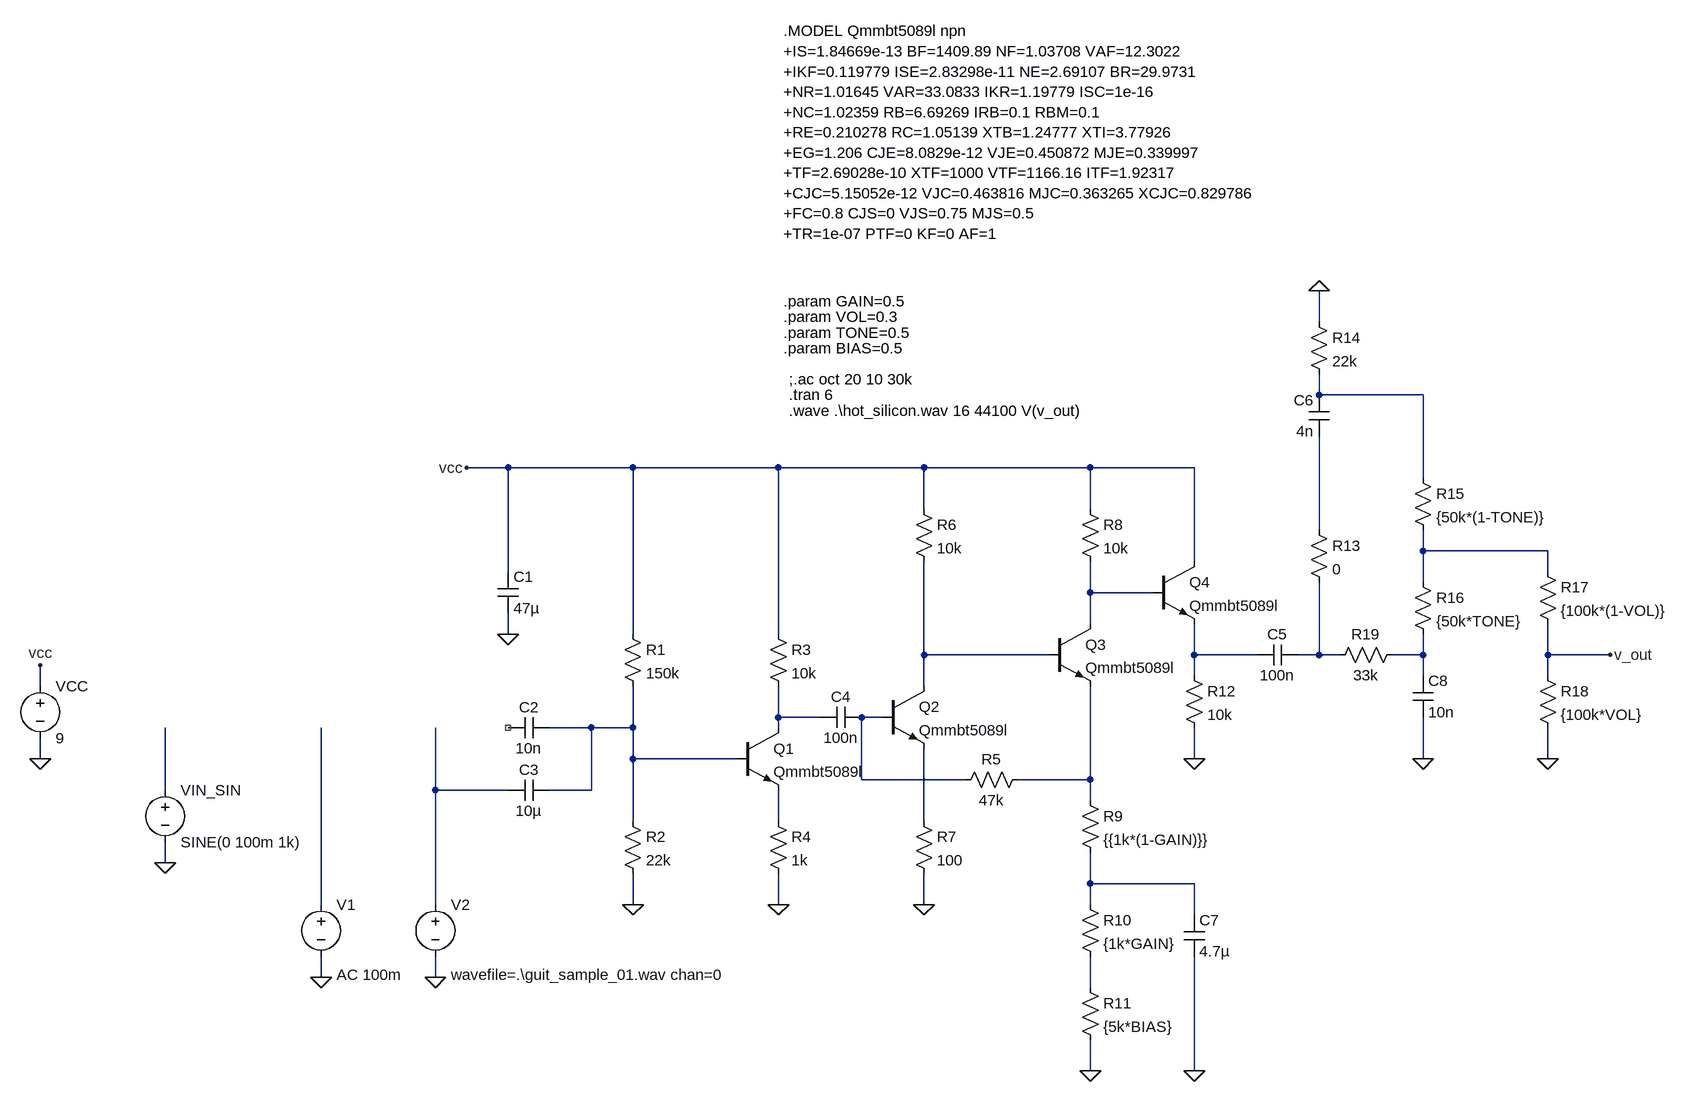
[diagram p0: schematic hot_silicon_02.asc]
hot_silicon_02.asc, the LTspice schematic file:
Version 4
SHEET 1 2596 884
WIRE 1568 -480 1568 -528
WIRE 1568 -368 1568 -400
WIRE 1728 -368 1568 -368
WIRE 320 -256 256 -256
WIRE 512 -256 320 -256
WIRE 736 -256 512 -256
WIRE 960 -256 736 -256
WIRE 1216 -256 960 -256
WIRE 1376 -256 1216 -256
WIRE 1728 -240 1728 -368
WIRE 960 -192 960 -256
WIRE 1216 -192 1216 -256
WIRE 1568 -160 1568 -304
WIRE 1728 -128 1728 -160
WIRE 1920 -128 1728 -128
WIRE 1376 -112 1376 -256
WIRE 320 -96 320 -256
WIRE 1920 -96 1920 -128
WIRE 1728 -80 1728 -128
WIRE 1216 -64 1216 -112
WIRE 1312 -64 1216 -64
WIRE 1216 -16 1216 -64
WIRE 320 0 320 -32
WIRE 512 0 512 -256
WIRE 736 0 736 -256
WIRE 960 32 960 -112
WIRE 1152 32 960 32
WIRE 1376 32 1376 -16
WIRE 1472 32 1376 32
WIRE 1568 32 1568 -80
WIRE 1568 32 1536 32
WIRE 1600 32 1568 32
WIRE 1728 32 1728 0
WIRE 1728 32 1680 32
WIRE 1920 32 1920 -16
WIRE 2016 32 1920 32
WIRE 1376 64 1376 32
WIRE 1728 64 1728 32
WIRE 1920 64 1920 32
WIRE -400 80 -400 48
WIRE 960 80 960 32
WIRE 736 128 736 80
WIRE 800 128 736 128
WIRE 896 128 864 128
WIRE 448 144 384 144
WIRE 512 144 512 80
WIRE 512 144 448 144
WIRE 736 144 736 128
WIRE -400 192 -400 160
WIRE 512 192 512 144
WIRE 672 192 512 192
WIRE 1376 192 1376 144
WIRE 1728 192 1728 128
WIRE 1920 192 1920 144
WIRE 864 224 864 128
WIRE 1024 224 864 224
WIRE 1216 224 1216 80
WIRE 1216 224 1104 224
WIRE -208 240 -208 144
WIRE 208 240 208 144
WIRE 320 240 208 240
WIRE 448 240 448 144
WIRE 448 240 384 240
WIRE 1216 256 1216 224
WIRE 512 288 512 192
WIRE 736 288 736 240
WIRE 960 288 960 176
WIRE -208 352 -208 320
WIRE 1216 384 1216 336
WIRE 1376 384 1216 384
WIRE 32 416 32 144
WIRE 208 416 208 240
WIRE 512 416 512 368
WIRE 736 416 736 368
WIRE 960 416 960 368
WIRE 1216 416 1216 384
WIRE 1376 432 1376 384
WIRE 32 528 32 496
WIRE 208 528 208 496
WIRE 1216 544 1216 496
WIRE 1216 672 1216 624
WIRE 1376 672 1376 496
FLAG -400 48 vcc
FLAG -400 192 0
FLAG -208 352 0
FLAG 1216 672 0
FLAG 1376 672 0
FLAG 1376 192 0
FLAG 320 0 0
FLAG 256 -256 vcc
FLAG 512 416 0
FLAG 736 416 0
FLAG 960 416 0
FLAG 1568 -528 0
FLAG 1728 192 0
FLAG 1920 192 0
FLAG 2016 32 v_out
FLAG 32 528 0
FLAG 208 528 0
SYMBOL voltage -400 64 R0
SYMATTR InstName VCC
SYMATTR Value 9
SYMBOL voltage -208 224 R0
WINDOW 123 0 0 Left 2
WINDOW 39 0 0 Left 2
SYMATTR InstName VIN_SIN
SYMATTR Value SINE(0 100m 1k)
SYMBOL res 496 -16 R0
SYMATTR InstName R1
SYMATTR Value 150k
SYMBOL res 496 272 R0
SYMATTR InstName R2
SYMATTR Value 22k
SYMBOL cap 304 -96 R0
SYMATTR InstName C1
SYMATTR Value 47µ
SYMBOL cap 384 128 R90
WINDOW 0 0 32 VBottom 2
WINDOW 3 32 32 VTop 2
SYMATTR InstName C2
SYMATTR Value 10n
SYMBOL cap 384 224 R90
WINDOW 0 0 32 VBottom 2
WINDOW 3 32 32 VTop 2
SYMATTR InstName C3
SYMATTR Value 10µ
SYMBOL res 720 -16 R0
SYMATTR InstName R3
SYMATTR Value 10k
SYMBOL res 720 272 R0
SYMATTR InstName R4
SYMATTR Value 1k
SYMBOL cap 864 112 R90
WINDOW 0 0 32 VBottom 2
WINDOW 3 32 32 VTop 2
SYMATTR InstName C4
SYMATTR Value 100n
SYMBOL res 1120 208 R90
WINDOW 0 0 56 VBottom 2
WINDOW 3 32 56 VTop 2
SYMATTR InstName R5
SYMATTR Value 47k
SYMBOL res 944 -208 R0
SYMATTR InstName R6
SYMATTR Value 10k
SYMBOL res 944 272 R0
SYMATTR InstName R7
SYMATTR Value 100
SYMBOL res 1200 -208 R0
SYMATTR InstName R8
SYMATTR Value 10k
SYMBOL res 1200 240 R0
SYMATTR InstName R9
SYMATTR Value {{1k*(1-GAIN)}}
SYMBOL res 1200 400 R0
SYMATTR InstName R10
SYMATTR Value {1k*GAIN}
SYMBOL res 1200 528 R0
SYMATTR InstName R11
SYMATTR Value {5k*BIAS}
SYMBOL res 1360 48 R0
SYMATTR InstName R12
SYMATTR Value 10k
SYMBOL cap 1536 16 R90
WINDOW 0 0 32 VBottom 2
WINDOW 3 32 32 VTop 2
SYMATTR InstName C5
SYMATTR Value 100n
SYMBOL res 1552 -176 R0
SYMATTR InstName R13
SYMATTR Value 0
SYMBOL res 1552 -496 R0
SYMATTR InstName R14
SYMATTR Value 22k
SYMBOL res 1712 -256 R0
SYMATTR InstName R15
SYMATTR Value {50k*(1-TONE)}
SYMBOL res 1712 -96 R0
SYMATTR InstName R16
SYMATTR Value {50k*TONE}
SYMBOL res 1904 -112 R0
SYMATTR InstName R17
SYMATTR Value {100k*(1-VOL)}
SYMBOL res 1904 48 R0
SYMATTR InstName R18
SYMATTR Value {100k*VOL}
SYMBOL cap 1584 -304 R180
WINDOW 0 24 56 Left 2
WINDOW 3 24 8 Left 2
SYMATTR InstName C6
SYMATTR Value 4n
SYMBOL cap 1360 432 R0
SYMATTR InstName C7
SYMATTR Value 4.7µ
SYMBOL npn 672 144 R0
SYMATTR InstName Q1
SYMATTR Value Qmmbt5089l
SYMBOL npn 896 80 R0
SYMATTR InstName Q2
SYMATTR Value Qmmbt5089l
SYMBOL npn 1152 -16 R0
SYMATTR InstName Q3
SYMATTR Value Qmmbt5089l
SYMBOL npn 1312 -112 R0
SYMATTR InstName Q4
SYMATTR Value Qmmbt5089l
SYMBOL res 1696 16 R90
WINDOW 0 0 56 VBottom 2
WINDOW 3 32 56 VTop 2
SYMATTR InstName R19
SYMATTR Value 33k
SYMBOL cap 1712 64 R0
SYMATTR InstName C8
SYMATTR Value 10n
SYMBOL voltage 32 400 R0
WINDOW 123 24 124 Left 2
WINDOW 39 0 0 Left 2
SYMATTR Value2 AC 100m
SYMATTR InstName V1
SYMATTR Value ""
SYMBOL voltage 208 400 R0
WINDOW 123 24 124 Left 2
WINDOW 39 0 0 Left 2
SYMATTR Value2 wavefile=.\guit_sample_01.wav chan=0
SYMATTR InstName V2
SYMATTR Value ""
TEXT 744 -512 Left 2 !.param GAIN=0.5
TEXT 744 -488 Left 2 !.param VOL=0.3
TEXT 744 -464 Left 2 !.param TONE=0.5
TEXT 744 -440 Left 2 !.param BIAS=0.5
TEXT 752 -368 Left 2 !.tran 6
TEXT 752 -344 Left 2 !.wave .\\hot_silicon.wav 16 44100 V(v_out)
TEXT 752 -392 Left 2 !;.ac oct 20 10 30k
TEXT 744 -928 Left 2 !.MODEL Qmmbt5089l npn\n+IS=1.84669e-13 BF=1409.89 NF=1.03708 VAF=12.3022\n+IKF=0.119779 ISE=2.83298e-11 NE=2.69107 BR=29.9731\n+NR=1.01645 VAR=33.0833 IKR=1.19779 ISC=1e-16\n+NC=1.02359 RB=6.69269 IRB=0.1 RBM=0.1\n+RE=0.210278 RC=1.05139 XTB=1.24777 XTI=3.77926\n+EG=1.206 CJE=8.0829e-12 VJE=0.450872 MJE=0.339997\n+TF=2.69028e-10 XTF=1000 VTF=1166.16 ITF=1.92317\n+CJC=5.15052e-12 VJC=0.463816 MJC=0.363265 XCJC=0.829786\n+FC=0.8 CJS=0 VJS=0.75 MJS=0.5\n+TR=1e-07 PTF=0 KF=0 AF=1

The netlist it stands for:
* hot_silicon_02.asc
VCC vcc 0 9
VIN_SIN N013 0 SINE(0 100m 1k)
R1 vcc N011 150k
R2 N011 0 22k
C1 vcc 0 47µ
C2 N011 NC_01 10n
C3 N011 N014 10µ
R3 vcc N009 10k
R4 N015 0 1k
C4 N010 N009 100n
R5 N012 N010 47k
R6 vcc N005 10k
R7 N016 0 100
R8 vcc N004 10k
R9 N012 N017 {{1k*(1-GAIN)}}
R10 N017 N019 {1k*GAIN}
R11 N019 0 {5k*BIAS}
R12 N006 0 10k
C5 N007 N006 100n
R13 N002 N007 0
R14 0 N001 22k
R15 N001 N003 {50k*(1-TONE)}
R16 N003 N008 {50k*TONE}
R17 N003 v_out {100k*(1-VOL)}
R18 v_out 0 {100k*VOL}
C6 N002 N001 4n
C7 N017 0 4.7µ
Q1 N009 N011 N015 0 Qmmbt5089l
Q2 N005 N010 N016 0 Qmmbt5089l
Q3 N004 N005 N012 0 Qmmbt5089l
Q4 vcc N004 N006 0 Qmmbt5089l
R19 N008 N007 33k
C8 N008 0 10n
V1 N018 0 AC 100m
V2 N014 0 wavefile=.\guit_sample_01.wav chan=0
.model NPN NPN
.model PNP PNP
.lib standard.bjt
.param GAIN=0.5
.param VOL=0.3
.param TONE=0.5
.param BIAS=0.5
.tran 6
.wave .\hot_silicon.wav 16 44100 V(v_out)
;.ac oct 20 10 30k
.MODEL Qmmbt5089l npn
+IS=1.84669e-13 BF=1409.89 NF=1.03708 VAF=12.3022
+IKF=0.119779 ISE=2.83298e-11 NE=2.69107 BR=29.9731
+NR=1.01645 VAR=33.0833 IKR=1.19779 ISC=1e-16
+NC=1.02359 RB=6.69269 IRB=0.1 RBM=0.1
+RE=0.210278 RC=1.05139 XTB=1.24777 XTI=3.77926
+EG=1.206 CJE=8.0829e-12 VJE=0.450872 MJE=0.339997
+TF=2.69028e-10 XTF=1000 VTF=1166.16 ITF=1.92317
+CJC=5.15052e-12 VJC=0.463816 MJC=0.363265 XCJC=0.829786
+FC=0.8 CJS=0 VJS=0.75 MJS=0.5
+TR=1e-07 PTF=0 KF=0 AF=1
.backanno
.end